# EAGLE design Power Board rev2.2 (EAGLE 8.1.0)
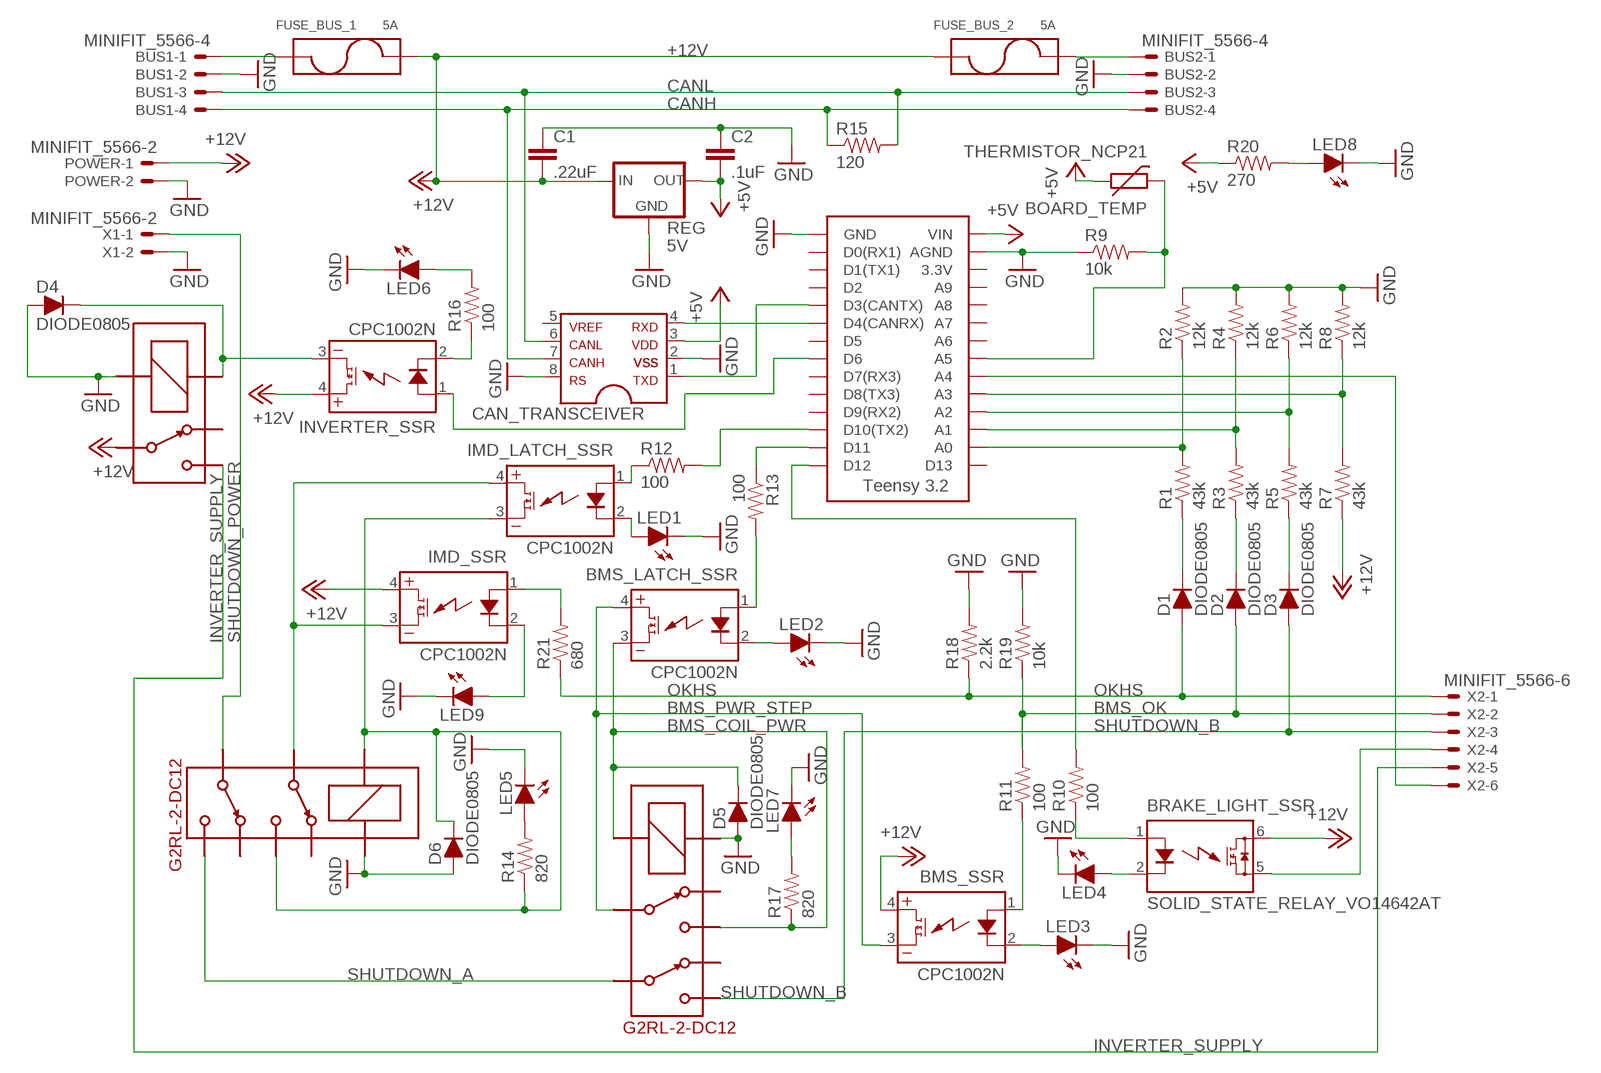
[diagram p0: schematic, sheet 1]

## Parts
BMS_LATCH_SSR  CPC1002N  [SOP04]
BMS_SSR  CPC1002N  [SOP04]
BOARD_TEMP  THERMISTOR_NCP21  [0805]
BRAKE_LIGHT_SSR  SOLID_STATE_RELAY_VO14642AT  [DIL06]
BUS1  MINIFIT_5566-4  [MINIFIT_5566-4]
BUS2  MINIFIT_5566-4  [MINIFIT_5566-4]
C1  .22uF  CAP0805  [0805]
C2  .1uF  CAP0805  [0805]
CAN_TRANSCEIVER  MCP2551  [SOIC-08]
D1  DIODE0805  [0805_D]
D2  DIODE0805  [0805_D]
D3  DIODE0805  [0805_D]
D4  DIODE0805  [0805_D]
D5  DIODE0805  [0805_D]
D6  DIODE0805  [0805_D]
FUSE_BUS_1  5A  FUSE_MINIBLADE  [MINI-BLADE_FUSE_HOLDER]
FUSE_BUS_2  5A  FUSE_MINIBLADE  [MINI-BLADE_FUSE_HOLDER]
IMD_LATCH_SSR  CPC1002N  [SOP04]
IMD_SHUTDOWN  G2RL-2-DC12  [G2RL-2]
IMD_SHUTDOWN1  G2RL-2-DC12  [G2RL-2]
IMD_SSR  CPC1002N  [SOP04]
INVERTER_SSR  CPC1002N  [SOP04]
LED1  LED-0805  [LED-805]
LED2  LED-0805  [LED-805]
LED3  LED-0805  [LED-805]
LED4  LED-0805  [LED-805]
LED5  LED-0805  [LED-805]
LED6  LED-0805  [LED-805]
LED7  LED-0805  [LED-805]
LED8  LED-0805  [LED-805]
LED9  LED-0805  [LED-805]
POWER  MINIFIT_5566-2  [MINIFIT_5566-2]
R1  43k  RESISTOR0805-RES  [0805]
R2  12k  RESISTOR0805-RES  [0805]
R3  43k  RESISTOR0805-RES  [0805]
R4  12k  RESISTOR0805-RES  [0805]
R5  43k  RESISTOR0805-RES  [0805]
R6  12k  RESISTOR0805-RES  [0805]
R7  43k  RESISTOR0805-RES  [0805]
R8  12k  RESISTOR0805-RES  [0805]
R9  10k  RESISTOR0805-RES  [0805]
R10  100  RESISTOR0805-RES  [0805]
R11  100  RESISTOR0805-RES  [0805]
R12  100  RESISTOR0805-RES  [0805]
R13  100  RESISTOR0805-RES  [0805]
R14  820  RESISTOR0805-RES  [0805]
R15  120  RESISTOR0805-RES  [0805]
R16  100  RESISTOR0805-RES  [0805]
R17  820  RESISTOR0805-RES  [0805]
R18  2.2k  RESISTOR0805-RES  [0805]
R19  10k  RESISTOR0805-RES  [0805]
R20  270  RESISTOR0805-RES  [0805]
R21  680  RESISTOR0805-RES  [0805]
REG  5V  5V_REGULATOR_LM340-NLM340MPX-5.0/NOPB  [SOT223]
U$1  G5LE  [ZF112]
U$3  TEENSY_3.2_SIMPLE  [TEENSY_3.2_SIMPLE]
X1  MINIFIT_5566-2  [MINIFIT_5566-2]
X2  MINIFIT_5566-6  [MINIFIT_5566-6]

## Nets
12V_F1: BUS1.1 FUSE_BUS_1.L1(P1) FUSE_BUS_1.L2(P1)
12V_F2: BUS2.1 FUSE_BUS_2.R1(P2) FUSE_BUS_2.R2(P2)
12VSUPPLY_READ: R7.2 R8.1 U$3.A3
+5V: BOARD_TEMP.1 C2.2 CAN_TRANSCEIVER.3 R20.1 REG.3(OUT) U$3.VIN
+12V: BMS_SSR.4(DC+) BRAKE_LIGHT_SSR.6(IO1) C1.2 FUSE_BUS_1.R1(P2) FUSE_BUS_1.R2(P2) FUSE_BUS_2.L1(P1) FUSE_BUS_2.L2(P1) IMD_SSR.4(DC+) INVERTER_SSR.4(DC+) POWER.1 R7.1 REG.1(IN) U$1.P
BMS_COIL_PWR: BMS_LATCH_SSR.3(DC-) D5.C IMD_SHUTDOWN1.4 IMD_SHUTDOWN1.COIL- R17.1
BMS_OK: D2.A R11.2 R19.1 X2.2
BMS_OK_READ: R3.2 R4.1 U$3.A1
BMS_PWR_STEP: BMS_LATCH_SSR.4(DC+) BMS_SSR.3(DC-) IMD_SHUTDOWN1.3
CANH: BUS1.4 BUS2.4 CAN_TRANSCEIVER.7 R15.1
CANL: BUS1.3 BUS2.3 CAN_TRANSCEIVER.6 R15.2
GND: BUS1.2 BUS2.2 C1.1 C2.1 CAN_TRANSCEIVER.2 CAN_TRANSCEIVER.8 D4.A D5.A D6.A IMD_SHUTDOWN1.COIL+ IMD_SHUTDOWN.COIL+ LED1.C LED2.C LED3.C LED4.C LED5.C LED6.C LED7.C LED8.C LED9.C POWER.2 R2.2 R4.2 R6.2 R8.2 R9.1 R18.2 R19.2 REG.2(GND) REG.4(GND) U$1.2(COIL-) U$3.AGND U$3.GND X1.2
INVERTER_SUPPLY: U$1.S X2.5
N$1: IMD_LATCH_SSR.2(CONTROL-) LED1.A
N$2: CAN_TRANSCEIVER.4 U$3.D4(CANRX)
N$3: CAN_TRANSCEIVER.1 U$3.D3(CANTX)
N$4: BRAKE_LIGHT_SSR.5(IO2) X2.4
N$5: IMD_LATCH_SSR.1(CONTROL+) R12.1
N$6: D6.C IMD_LATCH_SSR.3(DC-) IMD_SHUTDOWN.4 IMD_SHUTDOWN.COIL- R14.1
N$7: BRAKE_LIGHT_SSR.2(LED-) LED4.A
N$8: R12.2 U$3.D10(TX2)
N$9: BMS_SSR.2(CONTROL-) LED3.A
N$12: BMS_LATCH_SSR.1(CONTROL+) R13.2
N$13: R10.2 U$3.D12
N$14: R13.1 U$3.D11
N$15: BOARD_TEMP.2 R9.2 U$3.A5
N$16: BMS_LATCH_SSR.2(CONTROL-) LED2.A
N$17: BRAKE_LIGHT_SSR.1(LED+) R10.1
N$18: BMS_SSR.1(CONTROL+) R11.1
N$19: LED5.A R14.2
N$20: U$3.A4 X2.6
N$21: INVERTER_SSR.1(CONTROL+) U$3.D6
N$22: D1.C R1.1
N$23: D2.C R3.1
N$24: D3.C R5.1
N$26: D4.C INVERTER_SSR.3(DC-) U$1.1(COIL+)
N$27: INVERTER_SSR.2(CONTROL-) R16.1
N$28: LED6.A R16.2
N$29: LED8.A R20.2
N$30: IMD_LATCH_SSR.4(DC+) IMD_SHUTDOWN.3 IMD_SSR.3(DC-)
N$31: IMD_SSR.1(CONTROL+) R21.2
N$32: LED7.A R17.2
N$34: IMD_SSR.2(CONTROL-) LED9.A
OKHS: D1.A R18.1 R21.1 X2.1
OKHS_READ: R1.2 R2.1 U$3.A0
SHUTDOWN_A: IMD_SHUTDOWN1.6 IMD_SHUTDOWN.5
SHUTDOWN_B: D3.A IMD_SHUTDOWN1.5 X2.3
SHUTDOWN_OUT_READ: R5.2 R6.1 U$3.A2
SHUTDOWN_POWER: IMD_SHUTDOWN.6 X1.1
Unconnected: CAN_TRANSCEIVER.5 IMD_SHUTDOWN1.2 IMD_SHUTDOWN1.7 IMD_SHUTDOWN.2 IMD_SHUTDOWN.7 U$1.O U$3.3.3V U$3.A6 U$3.A7 U$3.A8 U$3.A9 U$3.D0(RX1) U$3.D1(TX1) U$3.D2 U$3.D5 U$3.D7(RX3) U$3.D8(TX3) U$3.D9(RX2) U$3.D13

## Library data of the parts
BMS_LATCH_SSR BMS_SSR IMD_LATCH_SSR IMD_SSR INVERTER_SSR = HyTechDevices:CPC1002N: IXYS Solid State Relay .7A
BOARD_TEMP = HyTechDevices:THERMISTOR_NCP21: Murata NCP21 10k Thermistor Datasheet <http://www.murata.com/~/media/webrenewal/support/library/catalog/products/thermistor/ntc/r44e.ashx>
BRAKE_LIGHT_SSR = HyTechDevices:SOLID_STATE_RELAY
BUS1 BUS2 = HyTechDevices:MINIFIT_5566-4: Mini-Fit Junior connector 4 pole Source: http://www.molex.com; OC_FARNELL: unknown; OC_NEWARK: unknown
C1 C2 = HyTechDevices:CAP: Capacitor Standard 0603 ceramic capacitor, and 0.1" leaded capacitor.
CAN_TRANSCEIVER = HyTechDevices:MCP2551: MCP2551 High-Speed CAN Transceiver Product Webpage <https://www.microchip.com/wwwproducts/en/MCP2551> Datasheet <http://ww1.microchip.com/downloads/en/DeviceDoc/21667f.pdf> This device is outdated It is replaced by MCP2561. Comparison Page <https://www.microchip.com/wwwproducts/ProductCompare/MCP2551/MCP2561> Product Webpage <https://www.microchip.com/wwwproducts/en/MCP2561> Datasheet <http://ww1.microchip.com/downloads/en/DeviceDoc/20005167C.pdf>
D1-D6 = HyTechDevices:DIODE: DIODE general purpose rectifier
FUSE_BUS_1 FUSE_BUS_2 = HyTechDevices:FUSE: Fuse/Fuseclips Keystone Electronics 3568 Fuse Mouser Part <http://www.mouser.com/ProductDetail/Keystone-Electronics/3568> Datasheet <http://www.mouser.com/ds/2/215/568-742601.pdf> Bussman/Eaton Midget Fuse Clip 1A3400 <http://www.mouser.com/ProductDetail/Bussmann-Eaton/BK-1A3400-09-R/?qs=sGAEpiMZZMuG%252bgnN5hGYGzzlAelq2OxnKqVSMVjq8I4%3d> Schurter 0751.0110 Brass Fuse Clip Datasheet <http://www.mouser.com/ds/2/358/typ_OG__Clip__5x20-2553.pdf>
IMD_SHUTDOWN IMD_SHUTDOWN1 = HyTechDevices:G2RL-2-DC12: Omron G2RL-2 Double Pull Double Throw Relay Coil Voltage: 12VDC (8.4-18VDC @60ºC) Contact Amperage: 8A at 30VDC Datasheet <https://www.omron.com/ecb/products/pdf/en-g2rl.pdf>
LED1-LED9 = HyTechDevices:LED: Light Emitting Diode (LED) Source: Dangerous Prototypes Eagle Library <https://github.com/DangerousPrototypes/Eagle_Part_Library>
POWER X1 = HyTechDevices:MINIFIT_5566-2: Mini-Fit Junior connector 2 pole Source: http://www.molex.com; OC_FARNELL: 1822072; OC_NEWARK: unknown
R1-R21 = HyTechDevices:RESISTOR: Resistor Basic schematic elements and footprints for 0603, 1206, and PTH resistors.
REG = HyTechDevices:5V_REGULATOR_LM340-N: Voltage Regulator 5v linear voltage regulator Datasheet <http://www.mouser.com/ProductDetail/Texas-Instruments/LM340MPX-50-NOPB/?qs=X1J7HmVL2ZGZwtTFRQ9ItA%3D%3D> MAX current out: 1.5A MAX voltage in: 35V
U$1 = HyTechDevices:G5LE: Omron G5LE SPST Relay 5 VDC, 12VDC, 24VDC models Coil voltage: 75% - 170% of nominal voltage Datasheet <https://www.omron.com/ecb/products/pdf/en-g5le.pdf>
U$3 = HyTechDevices:TEENSY_3.2_SIMPLE: Simple version of the Teensy 3.2 board that only uses the 2 main rows of pins, not the inner pins or the pins opposite the usb port.
X2 = HyTechDevices:MINIFIT_5566-6: Mini-Fit Junior connector 6 pole Source: http://www.molex.com; MPN: 95566-61002; OC_FARNELL: unknown; OC_NEWARK: 22K8620

## Board
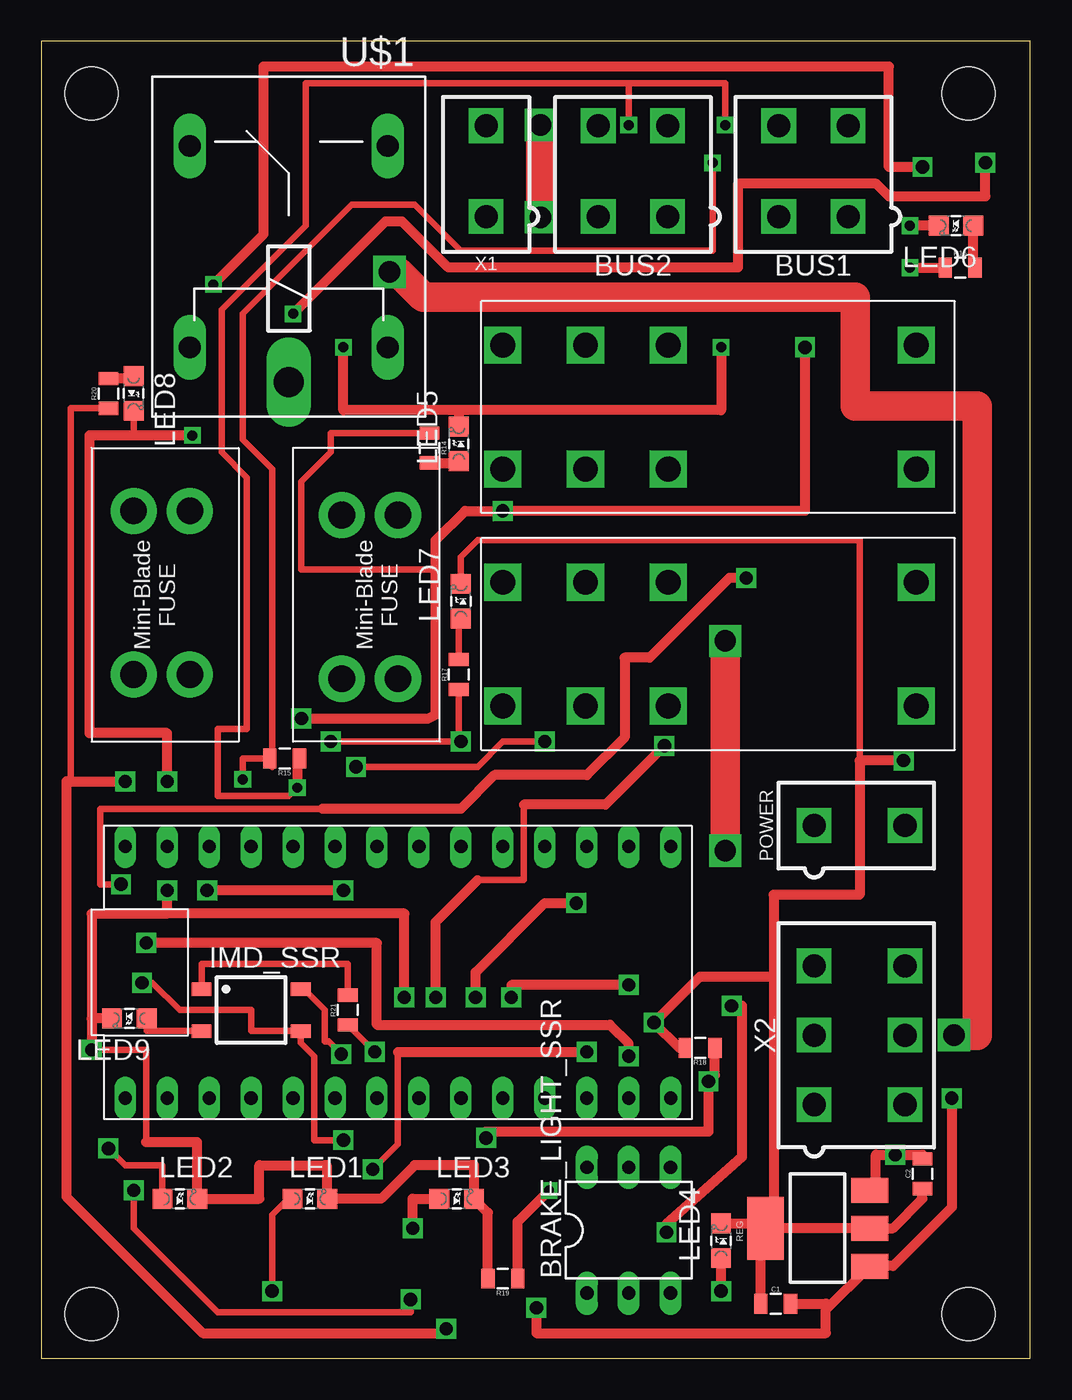
[diagram p1: board, top side]
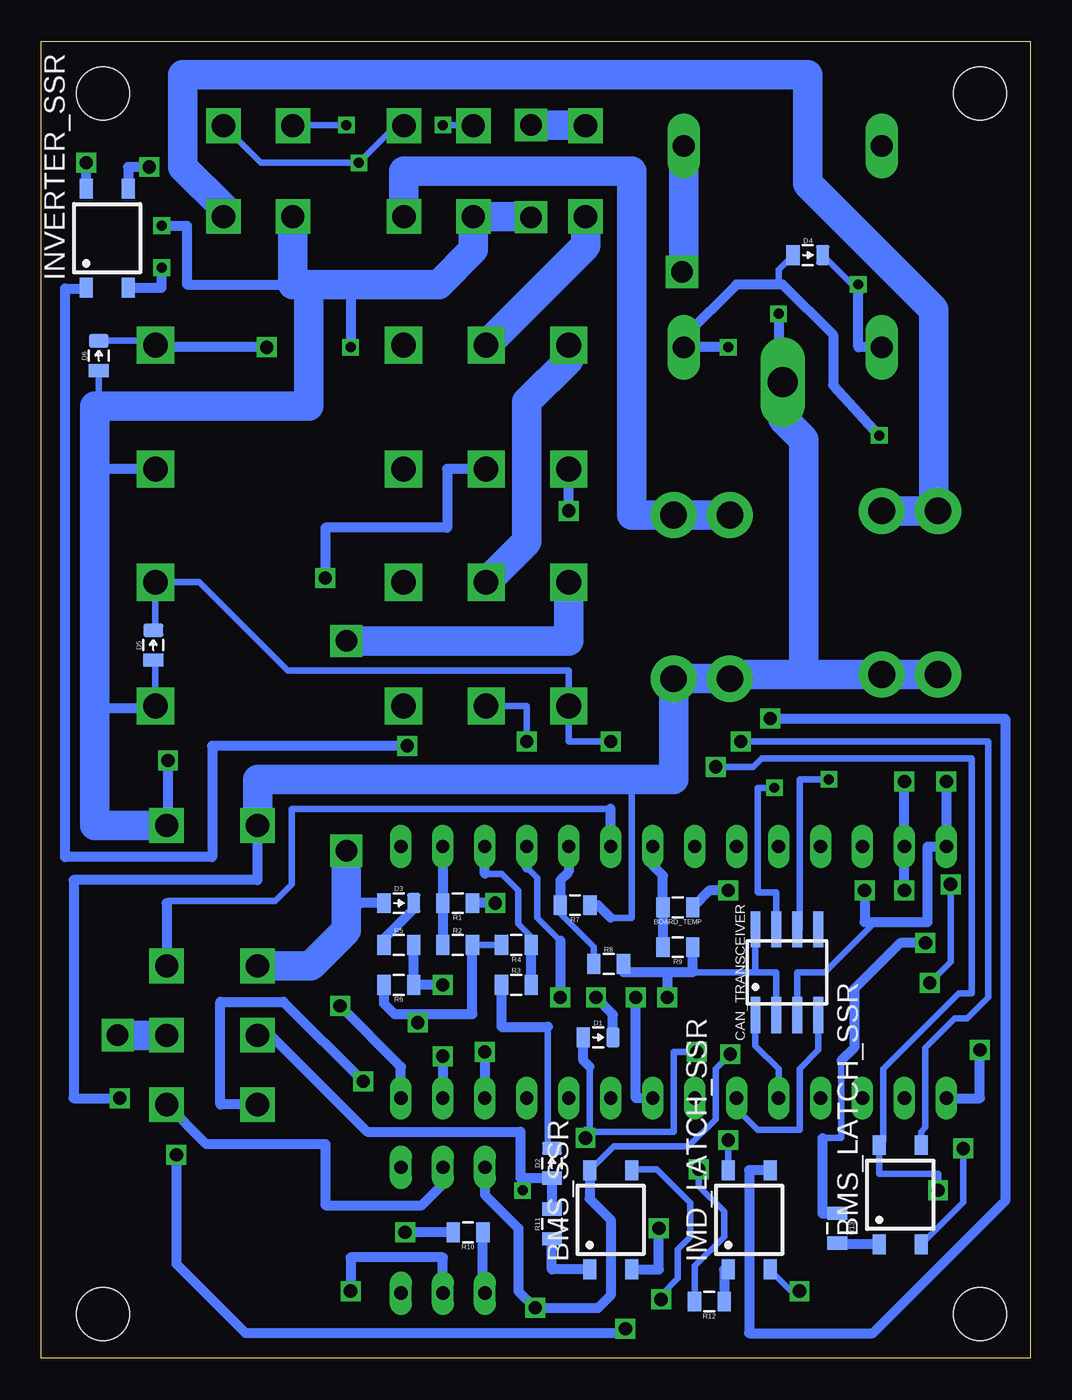
[diagram p2: board, bottom side, seen from below]

Size 59.87 x 79.75 mm. Coordinates in mm from the lower left corner, seen from the top.
Outline: 0,0 59.87,0 59.87,79.75 0,79.75 0,0
Copper layers (1*16): Top 0.035mm / dielectric 1.5mm / Bottom 0.035mm
Design rules "default": minimum track width 10mil, minimum drill 24mil, track to track 8mil, track to pad 8mil, pad to pad 8mil, via to via 8mil, smd to smd 8mil, copper to edge 40mil, drill to drill 8mil, minimum pad ring 10mil, minimum via ring 8mil, stop-mask expansion 4mil, vias tented up to drill 0mil, thermal gap 10mil
Holes 3.2 mm at 3.05,76.58 56.13,76.58 3.05,2.67 56.13,2.67

### Footprints (pad centres in the part's own frame; a part is rotated, then mirrored left to right if it is on the bottom)
SOP04 = smd 0.8 x 1.2: 1 -1.27,-3; 2 1.27,-3; 3 1.27,3; 4 -1.27,3
0805 = smd 0.8 x 1.2: 1 -0.9,0; 2 0.9,0
DIL06 = drill 0.813 long: 1 -2.54,-3.81; 2 0,-3.81; 3 2.54,-3.81; 4 2.54,3.81; 5 0,3.81; 6 -2.54,3.81
MINIFIT_5566-4 = drill 1.4 square: 1 2.1,-2.75; 2 -2.1,-2.75; 3 2.1,2.75; 4 -2.1,2.75
SOIC-08 = smd 0.6 x 2.2: 1 -1.905,-2.6; 2 -0.635,-2.6; 3 0.635,-2.6; 4 1.905,-2.6; 5 1.905,2.6; 6 0.635,2.6; 7 -0.635,2.6; 8 -1.905,2.6
0805_D = smd 0.8 x 1.2: A -0.9,0; C 0.9,0
MINI-BLADE_FUSE_HOLDER = drill 1.613 pad 2.794: L1 0,3.404; L2 0,0; R1 9.906,3.404; R2 9.906,0
G2RL-2 = drill 1.5 square: 2 10.008,0; 3 5.004,0; 4 0,0; 5 0,7.493; 6 5.004,7.493; 7 10.008,7.493; COIL+ 25.019,0; COIL- 25.019,7.493
LED-805 = smd 1.2 x 1.2: A 0,-1.05; C 0,1.05
MINIFIT_5566-2 = drill 1.4 square: 1 0,-2.75; 2 0,2.75
SOT223 = smd 1.5 x 2.235: 1 -2.3,-3.15; 2 0,-3.15; 3 2.3,-3.15 | smd 3.8 x 2.2: 4 0,3.15
ZF112 = drill 1.321 long: 1 4.064,14.884; 2 4.064,2.896; O 16.256,14.884; S 16.256,2.896 | drill 1.803 long: P 1.956,8.89
TEENSY_3.2_SIMPLE = drill 0.8 long: 3.3V 16.51,29.21; A0 16.51,3.81; A1 16.51,6.35; A2 16.51,8.89; A3 16.51,11.43; A4 16.51,13.97; A5 16.51,16.51; A6 16.51,19.05; A7 16.51,21.59; A8 16.51,24.13; A9 16.51,26.67; AGND 16.51,31.75; D0(RX1) 1.27,31.75; D1(TX1) 1.27,29.21; D2 1.27,26.67; D3(CANTX) 1.27,24.13; D4(CANRX) 1.27,21.59; D5 1.27,19.05; D6 1.27,16.51; D7(RX3) 1.27,13.97; D8(TX3) 1.27,11.43; D9(RX2) 1.27,8.89; D10(TX2) 1.27,6.35; D11 1.27,3.81; D12 1.27,1.27; D13 16.51,1.27; GND 1.27,34.29; VIN 16.51,34.29
MINIFIT_5566-6 = drill 1.4 square: 1 4.2,-2.75; 2 0,-2.75; 3 -4.2,-2.75; 4 4.2,2.75; 5 0,2.75; 6 -4.2,2.75

### Placement (x,y rotation side)
BMS_LATCH_SSR  7.87,9.91 0 bottom
BMS_SSR  25.4,8.38 0 bottom
BOARD_TEMP  21.34,27.3 180 bottom
BRAKE_LIGHT_SSR  35.56,7.75 0 top
BUS1  46.74,71.88 0 top
BUS2  35.81,71.88 0 top
C1  44.45,3.3 0 top
C2  53.34,11.18 90 top
CAN_TRANSCEIVER  14.73,23.37 0 bottom
D1  26.16,19.43 0 bottom
D2  28.96,11.81 90 bottom
D3  38.23,27.56 0 bottom
D4  13.46,66.8 0 bottom
D5  53.09,43.18 90 bottom
D6  56.39,60.71 90 bottom
FUSE_BUS_1  5.59,51.31 270 top
FUSE_BUS_2  21.59,41.15 90 top
IMD_LATCH_SSR  17.02,8.38 0 bottom
IMD_SHUTDOWN  27.94,53.85 0 top
IMD_SHUTDOWN1  27.94,39.5 0 top
IMD_SSR  12.7,21.08 270 top
INVERTER_SSR  55.88,67.82 0 bottom
LED1  16.26,9.65 270 top
LED2  8.38,9.65 270 top
LED3  25.15,9.65 270 top
LED4  41.15,7.11 0 top
LED5  25.27,55.37 0 top
LED6  55.37,68.58 90 top
LED7  25.4,45.85 0 top
LED8  5.59,58.42 180 top
LED9  5.33,20.57 90 top
POWER  49.53,32.26 270 top
R1  34.67,27.56 180 bottom
R2  34.67,25.02 0 bottom
R3  31.11,22.61 0 bottom
R4  31.11,25.02 180 bottom
R5  38.23,25.02 0 bottom
R6  38.23,22.61 180 bottom
R7  27.56,27.43 180 bottom
R8  25.53,23.88 0 bottom
R9  21.34,24.89 180 bottom
R10  34.04,7.62 180 bottom
R11  28.96,8.13 90 bottom
R12  19.43,3.43 180 bottom
R13  11.68,7.87 270 bottom
R14  23.5,55.12 270 top
R15  14.73,36.32 180 top
R16  55.63,66.04 0 top
R17  25.27,41.4 90 top
R18  39.88,18.8 180 top
R19  27.94,4.83 180 top
R20  4.06,58.42 90 top
R21  18.54,21.08 90 top
REG  46.99,7.87 90 top
U$1  23.88,57.15 90 top
U$3  39.37,14.48 90 top
X1  26.92,71.88 0 top
X2  49.53,19.56 270 top

### Tracks (layer width: path | path; a pad name or v marks a point on that pad's centre or on a via)
12V_F1
  Bottom 1.778: FUSE_BUS_1.L2 5.84,51.31 | 5.84,51.31 FUSE_BUS_1.L1 | BUS1.1 48.84,69.66 51.31,72.14 51.31,77.72 13.46,77.72 13.46,71.12 5.84,63.5 5.84,51.31
12V_F2
  Bottom 1.778: BUS2.1 37.91,71.88 24.13,71.88 24.13,51.05 FUSE_BUS_2.R2 FUSE_BUS_2.R1
12VSUPPLY_READ
  Bottom 0.406: 26.42,23.89 26.42,24.89 28.45,26.92 28.45,27.42 R7.2
  Bottom 0.61: U$3.A3 27.95,30.99 27.95,29.45 28.45,28.96 28.45,27.44 R7.2 | 26.42,23.89 R8.1
+5V  (via drill 0.8)
  Top 0.406: R20.1 1.78,57.54 1.78,34.92
  Top 0.61: v18.29,28.32 v10.03,28.32 | v5.08,34.92 1.78,34.92 1.52,34.92 1.52,9.78 9.78,1.52 24.26,1.52 v24.51,1.78 | REG.3 50.52,10.55 50.52,12.32 v51.69,12.32 53.34,12.32 C2.2
  Bottom 0.406: CAN_TRANSCEIVER.3 14.1,23.37 12.45,23.37 9.4,26.42
  Bottom 0.61: v10.03,28.32 10.03,26.42 9.4,26.42 6.22,26.42 6.22,30.99 U$3.VIN v5.08,34.92 | v51.69,12.32 51.69,5.71 47.5,1.52 24.77,1.52 v24.51,1.78 | v18.29,28.32 19.42,28.32 BOARD_TEMP.1
+12V  (via drill 0.6, 0.8)
  Top 0.406: IMD_SSR.4 15.88,22.35 17.14,21.08 17.14,19.18 17.4,19.18 v18.16,18.41
  Top 0.61: v29.97,3.05 29.97,1.52 47.5,1.52 47.5,2.93 | 47.5,2.93 REG.1 50.15,5.59 51.56,5.59 55.12,9.14 v55.12,15.75 | v15.24,63.25 20.83,68.83 21.84,68.83 24.64,66.04 42.16,66.04 42.16,71.12 50.55,71.12 51.31,70.36 57.15,70.36 v57.15,72.39 | C1.2 47.5,3.3 47.5,2.93
  Bottom 0.406: 24.13,35.05 24.13,26.67 25.4,26.67 | v18.16,18.41 19.05,17.53 19.05,14.48 20.7,12.83 25.23,12.83 BMS_SSR.4
  Bottom 0.61: INVERTER_SSR.4 v57.15,72.39 | BRAKE_LIGHT_SSR.6 33.02,9.91 30.99,7.87 30.99,4.06 v29.97,3.05 26.16,3.05 25.4,3.81 25.4,8.38 26.67,9.65 BMS_SSR.4 | POWER.1 46.78,28.96 57.91,28.96 57.91,15.75 v55.12,15.75 | v15.24,63.25 15.24,59.36 U$1.P | R7.1 26.16,27.43 25.4,26.67
  Bottom 1.778: FUSE_BUS_1.R2 FUSE_BUS_1.R1 13.46,41.4 | 13.46,41.4 18.19,41.4 FUSE_BUS_2.L1 FUSE_BUS_2.L2 21.59,35.05 24.13,35.05 46.78,35.05 POWER.1 | U$1.P 14.99,56.9 13.72,55.63 13.72,41.66 13.46,41.4
BMS_COIL_PWR  (via drill 0.8)
  Top 0.406: v17.53,37.34 v25.4,37.34 25.27,37.34 R17.1
  Bottom 0.406: BMS_LATCH_SSR.3 6.6,13.72 6.35,13.97 6.35,18.8 4.57,20.57 3.81,20.57 2.54,21.84 2.54,37.34 v17.53,37.34 | v25.4,37.34 27.94,37.34 IMD_SHUTDOWN1.4 27.94,41.66 44.96,41.66 50.29,46.99 IMD_SHUTDOWN1.COIL- 52.96,44.21 D5.C
BMS_OK  (via drill 0.6)
  Top 0.61: R19.1 28.84,8.27 v30.73,10.16
  Bottom 0.61: 30.86,10.92 30.86,13.72 40.13,13.72 45.97,19.56 X2.2 | 30.86,10.92 29.21,10.92 D2.A R11.2 | v30.73,10.16 30.73,10.79 30.86,10.92
BMS_OK_READ
  Bottom 0.406: R4.1 30.23,25.02 30.23,25.53 30.99,26.29 30.99,28.32 32,29.34 33.02,29.34
  Bottom 0.61: R3.2 R4.1 | 33.02,29.34 U$3.A1
BMS_PWR_STEP  (via drill 0.8)
  Top 0.406: v22.35,3.56 22.35,2.79 10.67,2.79 5.59,7.87 v5.59,10.16 | v19.05,35.81 26.42,35.81 27.94,37.34 v30.48,37.34
  Bottom 0.406: v22.35,3.56 22.35,3.81 21.34,4.83 21.34,6.6 20.57,7.37 20.57,9.4 22.61,11.43 24.08,11.43 BMS_SSR.3 | v5.59,10.16 5.59,11.18 9.14,11.18 BMS_LATCH_SSR.4 8.89,13.16 8.89,17.53 4.32,22.1 3.56,22.1 3.56,36.32 16.26,36.32 16.76,35.81 v19.05,35.81 | IMD_SHUTDOWN1.3 30.48,39.5 v30.48,37.34
CANH  (via drill 0.6)
  Top 0.406: R15.1 15.49,35.81 | v41.4,74.68 41.4,77.22 35.56,77.22 | 35.56,77.22 v35.56,74.68 | 35.56,77.22 16,77.22 16,68.58 10.92,63.5 10.92,54.86 12.45,53.34 12.45,38.1 10.67,38.1 10.67,34.04 14.99,34.04 v15.49,34.54
  Top 0.61: 15.49,35.81 v15.49,34.54
  Bottom 0.406: v15.49,34.54 16.51,34.54 16.51,28.19 15.37,28.19 CAN_TRANSCEIVER.7 | BUS1.4 44.64,74.68 v41.4,74.68 | v35.56,74.68 33.71,74.68 BUS2.4
CANL  (via drill 0.6)
  Top 0.406: v12.19,35.05 12.19,36.32 R15.2 13.97,35.81 13.97,53.85 12.19,55.63 12.19,63.25 18.8,69.85 22.61,69.85 25.4,67.06 40.64,67.06 v40.64,72.39
  Bottom 0.406: CAN_TRANSCEIVER.6 13.97,25.97 13.97,35.05 v12.19,35.05 | BUS1.3 46.59,72.39 v40.64,72.39 38.4,74.63 BUS2.3
GND  (via drill 0.6, 0.8, 1.3)
  Top 0.406: 6.35,13.08 6.35,18.67 v3.05,18.67 | LED7.C 25.4,48.51 26.42,49.53 49.53,49.53 49.53,36.2 | LED8.C 5.59,55.88
  Top 0.61: LED6.C v52.58,68.58 | REG.4 REG.2 51.56,7.87 53.34,9.65 C2.1 | 17.27,11.68 17.27,11.56 | 17.27,11.56 17.27,9.91 LED1.C 20.57,9.65 22.61,11.68 26.2,11.68 LED3.C 27.04,8.81 R19.2 | 17.27,11.56 17.14,11.68 13.21,11.68 13.21,9.65 LED2.C 9.43,13.08 6.35,13.08 | v52.2,36.2 49.53,36.2 49.53,28.07 44.32,28.07 44.32,23.11 | v7.62,34.92 7.62,37.85 2.92,37.85 2.92,55.88 5.59,55.88 v9.14,55.88 | 44.32,23.11 39.88,23.11 v37.08,20.32 38.61,18.8 R18.2 | 7.62,26.92 21.97,26.92 v21.97,21.84 | 7.62,26.92 v7.62,28.32 | 3.05,20.57 3.05,26.92 7.62,26.92 | 3.05,20.57 v3.05,18.67 | LED4.C 43.84,8.16 REG.4 | 44.32,23.11 44.32,7.87 REG.4 | LED9.C 3.05,20.57 | v41.15,61.21 41.15,57.4 25.27,57.4 | 25.27,57.4 18.29,57.4 v18.29,61.21 | 25.27,57.4 LED5.C | C1.1 43.55,7.87 REG.4
  Top 1.778: v30.23,69.09 v30.23,74.68
  Bottom 0.406: CAN_TRANSCEIVER.2 15.37,23.37 16.64,23.37 | 16.64,23.37 CAN_TRANSCEIVER.8 | 20.57,23.37 16.64,23.37 | R2.2 R4.2 | D4.A 15.24,65.92 15.24,65.02 | D5.A 52.96,42.15 IMD_SHUTDOWN1.COIL+ 52.96,39.37 | D6.A 56.39,57.91 56.64,57.66
  Bottom 0.61: v52.58,68.58 51.05,68.58 51.05,65.02 44.64,65.02 | 35.81,64.52 35.81,65.02 | POWER.2 52.2,32.26 v52.2,36.2 | v7.62,34.92 U$3.AGND v7.62,28.32 | R9.1 20.44,23.37 20.57,23.37 21.97,23.37 | R2.2 33.77,20.83 37.08,20.83 | 21.97,23.37 24.63,23.37 R8.2 | 37.08,20.83 v37.08,20.32 | 37.08,20.83 38.48,20.83 39.12,21.46 39.12,22.59 R6.2 | 41.15,65.02 v41.15,61.21 | v9.14,55.88 11.94,58.93 11.94,61.98 14.99,65.02 15.24,65.02 17.78,65.02 20.98,61.82 U$1.2 v18.29,61.21 | IMD_SHUTDOWN.COIL+ 56.64,53.85 | U$3.GND 3.05,15.75 v3.05,18.67 | 21.97,23.37 v21.97,21.84 | 56.64,39.37 52.96,39.37
  Bottom 1.778: POWER.2 56.64,32.26 56.64,39.37 56.64,53.85 56.64,57.66 43.69,57.66 43.69,65.02 | 43.69,65.02 44.64,65.02 BUS1.2 | 43.69,65.02 41.15,65.02 35.81,65.02 33.71,67.12 BUS2.2 30.23,69.13 v30.23,69.09 | v30.23,74.68 26.92,74.68 X1.2
INVERTER_SUPPLY  (via drill 1.3)
  Top 1.778: 56.64,19.56 56.64,19.68 | 56.64,19.68 56.64,57.66 49.28,57.66 49.28,64.26 23.11,64.26 21.59,65.79 v21.08,65.79 | v55.24,19.56 56.52,19.56 56.64,19.68
  Bottom 1.778: X2.5 v55.24,19.56 | v21.08,65.79 20.98,65.89 U$1.S
N$1  (via drill 0.8)
  Top 0.406: v13.97,4.06 13.97,8.67 14.95,9.65 LED1.A
  Top 0.61: LED1.A 15.24,9.91
  Bottom 0.406: IMD_LATCH_SSR.2 15.75,5.33 14.48,4.06 v13.97,4.06
N$2
  Bottom 0.406: CAN_TRANSCEIVER.4 12.83,18.67 13.97,17.53 13.97,13.84 16.51,13.84 17.78,15.11 U$3.D4(CANRX)
N$3
  Bottom 0.406: U$3.D3(CANTX) 15.24,17.53 16.64,18.92 CAN_TRANSCEIVER.1
N$4
  Bottom 0.61: BRAKE_LIGHT_SSR.5 35.56,10.54 36.83,9.27 42.67,9.27 42.67,12.95 49.88,12.95 X2.4
N$5
  Bottom 0.61: IMD_LATCH_SSR.1 18.53,5.38 R12.1
N$6  (via drill 0.8)
  Top 0.406: 23.88,47.75 15.75,47.75 15.75,53.09 17.53,54.86 17.53,56.02 R14.1
  Top 0.61: v46.23,61.21 46.23,51.31 v27.94,51.31 25.65,51.31 23.88,49.53 23.88,47.75 23.88,38.98 23.38,38.73 v15.75,38.73
  Bottom 0.406: D6.C 53.22,61.61 IMD_SHUTDOWN.COIL-
  Bottom 0.61: v15.75,38.73 1.52,38.73 1.52,9.53 9.53,1.52 17.02,1.52 17.02,11.38 IMD_LATCH_SSR.3 | v27.94,51.31 IMD_SHUTDOWN.4 | v46.23,61.21 52.96,61.21 IMD_SHUTDOWN.COIL-
N$7  (via drill 0.8)
  Top 0.61: v41.15,4.06 LED4.A
  Bottom 0.61: BRAKE_LIGHT_SSR.2 35.56,6.1 41.15,6.1 v41.15,4.06
N$8  (via drill 0.8)
  Top 0.406: 21.59,18.54 21.59,12.95 v20.07,11.43
  Top 0.61: 21.59,18.54 v33.02,18.54
  Bottom 0.406: v20.07,11.43 20.07,10.41 18.54,8.89 18.54,7.37 20.32,5.59 R12.2
  Bottom 0.61: v33.02,18.54 U$3.D10(TX2)
N$9  (via drill 0.8)
  Top 0.61: v22.48,7.87 22.48,9.65 LED3.A
  Bottom 0.61: BMS_SSR.2 22.48,5.38 v22.48,7.87
N$12
  Bottom 0.61: BMS_LATCH_SSR.1 11.68,6.91 R13.2
N$13  (via drill 0.8)
  Top 0.61: v37.85,7.62 37.85,8.13 42.42,12.19 42.42,21.34 v41.78,21.34
  Bottom 0.61: R10.2 v37.85,7.62 | U$3.D12 38.1,17.65 v41.78,21.34
N$14  (via drill 0.8)
  Top 0.61: v35.56,18.29 35.56,19.05 34.42,20.19 20.32,20.19 20.32,25.15 v6.35,25.15
  Bottom 0.406: 12.57,13.34 11.43,13.34 11.43,18.03
  Bottom 0.61: 12.57,13.34 12.57,8.77 R13.1 | v35.56,18.29 U$3.D11 | v6.35,25.15 7.87,25.15 10.67,22.35 10.67,18.8 11.43,18.03
N$15
  Bottom 0.61: R9.2 BOARD_TEMP.2 22.24,29.22 22.86,29.84 U$3.A5
N$16  (via drill 0.8)
  Top 0.406: LED2.A 7.33,11.68 5.08,11.68 v4.06,12.7
  Bottom 0.406: v4.06,12.7 4.06,9.45 BMS_LATCH_SSR.2
N$17
  Bottom 0.61: BRAKE_LIGHT_SSR.1 33.14,4.06 33.14,5.07 33.15,5.59 33.15,6.97 R10.1
N$18
  Bottom 0.61: BMS_SSR.1 28.96,5.38 R11.1
N$19
  Top 0.61: R14.2 25.27,54.22 LED5.A
N$20
  Bottom 0.406: 25.4,33.27 44.7,33.27 44.7,28.7 45.72,27.69 52.15,27.69 52.28,27.56
  Bottom 0.61: U$3.A4 25.4,33.27 | 52.28,27.56 X2.6
N$21  (via drill 0.8)
  Top 0.406: 29.21,33.53 29.21,28.96 26.42,28.96
  Top 0.61: v23.88,21.84 23.88,26.42 26.42,28.96 | v37.72,37.08 34.16,33.53 29.21,33.53
  Bottom 0.61: U$3.D6 23.88,15.75 v23.88,21.84 | v37.72,37.08 49.53,37.08 49.53,30.35 58.42,30.35 58.42,64.77 57.15,64.77 INVERTER_SSR.1
N$22  (via drill 0.8)
  Top 0.61: v26.29,21.84 26.29,23.37 30.48,27.56 v32.38,27.56
  Bottom 0.61: v32.38,27.56 R1.1 | D1.C 25.26,20.82 v26.29,21.84
N$23
  Bottom 0.406: D2.C 29.21,12.96 29.21,20.07
  Bottom 0.61: R3.1 32.02,20.07 29.21,20.07
N$24
  Bottom 0.61: R5.1 39.13,25.39 37.34,27.18 37.34,27.55 D3.C
N$26  (via drill 0.6, 0.8)
  Top 0.61: v10.41,65.02 13.46,68.07 13.46,78.23 51.31,78.23 51.31,72.14 v53.34,72.14
  Bottom 0.406: D4.C 10.41,64.65 10.41,64.52
  Bottom 0.61: U$1.1 10.41,61.21 10.41,64.52 v10.41,65.02 | v53.34,72.14 54.61,72.14 INVERTER_SSR.3
N$27  (via drill 0.6)
  Top 0.61: v52.58,66.04 R16.1
  Bottom 0.61: INVERTER_SSR.2 52.58,64.82 v52.58,66.04
N$28
  Top 0.61: R16.2 56.42,66.04 LED6.A
N$29
  Top 0.61: LED8.A 5.59,59.32 R20.2
N$30  (via drill 0.8)
  Top 0.406: v18.29,13.21 16.51,13.21 16.51,18.29 15.7,19.1 IMD_SSR.3 12.7,19.81 12.7,21.08 8.38,21.08 6.73,22.73 v6.1,22.73 | 17.02,33.27 3.56,33.27 3.56,28.7 v4.83,28.7
  Top 0.61: v42.67,47.24 41.66,47.24 36.83,42.42 35.31,42.42 35.31,37.59 33.02,35.31 27.43,35.31 25.4,33.27 17.02,33.27
  Bottom 0.406: v18.29,13.21 IMD_LATCH_SSR.4 | v4.83,28.7 4.83,24 v6.1,22.73
  Bottom 0.61: IMD_SHUTDOWN.3 35.31,53.85 35.31,50.29 42.67,50.29 v42.67,47.24
N$31
  Top 0.406: R21.2 18.54,23.88 9.7,23.88 IMD_SSR.1
N$32
  Top 0.406: R17.2 25.27,45.05 LED7.A
N$34
  Top 0.406: IMD_SSR.2 6.38,19.81 LED9.A
OKHS  (via drill 0.8)
  Top 0.406: v20.19,18.54 v20.18,18.54 R21.1
  Top 0.61: v26.92,13.34 26.92,13.72 40.39,13.72 v40.39,16.76 40.78,17.16 R18.1
  Bottom 0.406: D1.A | 26.92,13.72 21.59,13.72 21.59,18.54 v20.19,18.54 | 26.67,17.65 26.67,13.59 v26.92,13.34
  Bottom 0.61: X2.1 49.02,15.36 49.02,21.59 45.21,21.59 v40.39,16.76 | 26.67,17.65 27.05,18.03 D1.A | v26.92,13.34 26.92,13.72
OKHS_READ
  Bottom 0.61: U$3.A0 R1.2 R2.1
SHUTDOWN_A
  Bottom 1.778: IMD_SHUTDOWN.5 27.94,60.45 30.48,57.91 30.48,49.45 IMD_SHUTDOWN1.6
SHUTDOWN_B  (via drill 1.3)
  Top 1.778: v41.4,43.43 v41.4,30.73
  Bottom 0.61: D3.A 40.51,27.56 41.4,26.92
  Bottom 1.778: IMD_SHUTDOWN1.5 27.94,43.43 v41.4,43.43 | v41.4,30.73 41.4,26.92 41.4,25.91 43.55,23.76 X2.3
SHUTDOWN_OUT_READ  (via drill 0.8)
  Top 0.61: v35.56,22.61 28.45,22.61 v28.45,21.84
  Bottom 0.406: 28.45,25.27 29.84,26.67 29.84,29.08 30.48,29.72
  Bottom 0.61: R5.2 R6.1 v35.56,22.61 | 28.45,25.27 v28.45,21.84 | 30.48,29.72 U$3.A2
SHUTDOWN_POWER
  Bottom 1.778: IMD_SHUTDOWN.6 26.92,67.36 X1.1

### Text on the board
tDocu: HyTech 2017 | BMS LATCH | IMD LATCH | BMS | power_board_rev2.2